# Altium schematic sheet Revisions.SchDoc
size A4; SheetNumber: 2; SheetTotal: 5
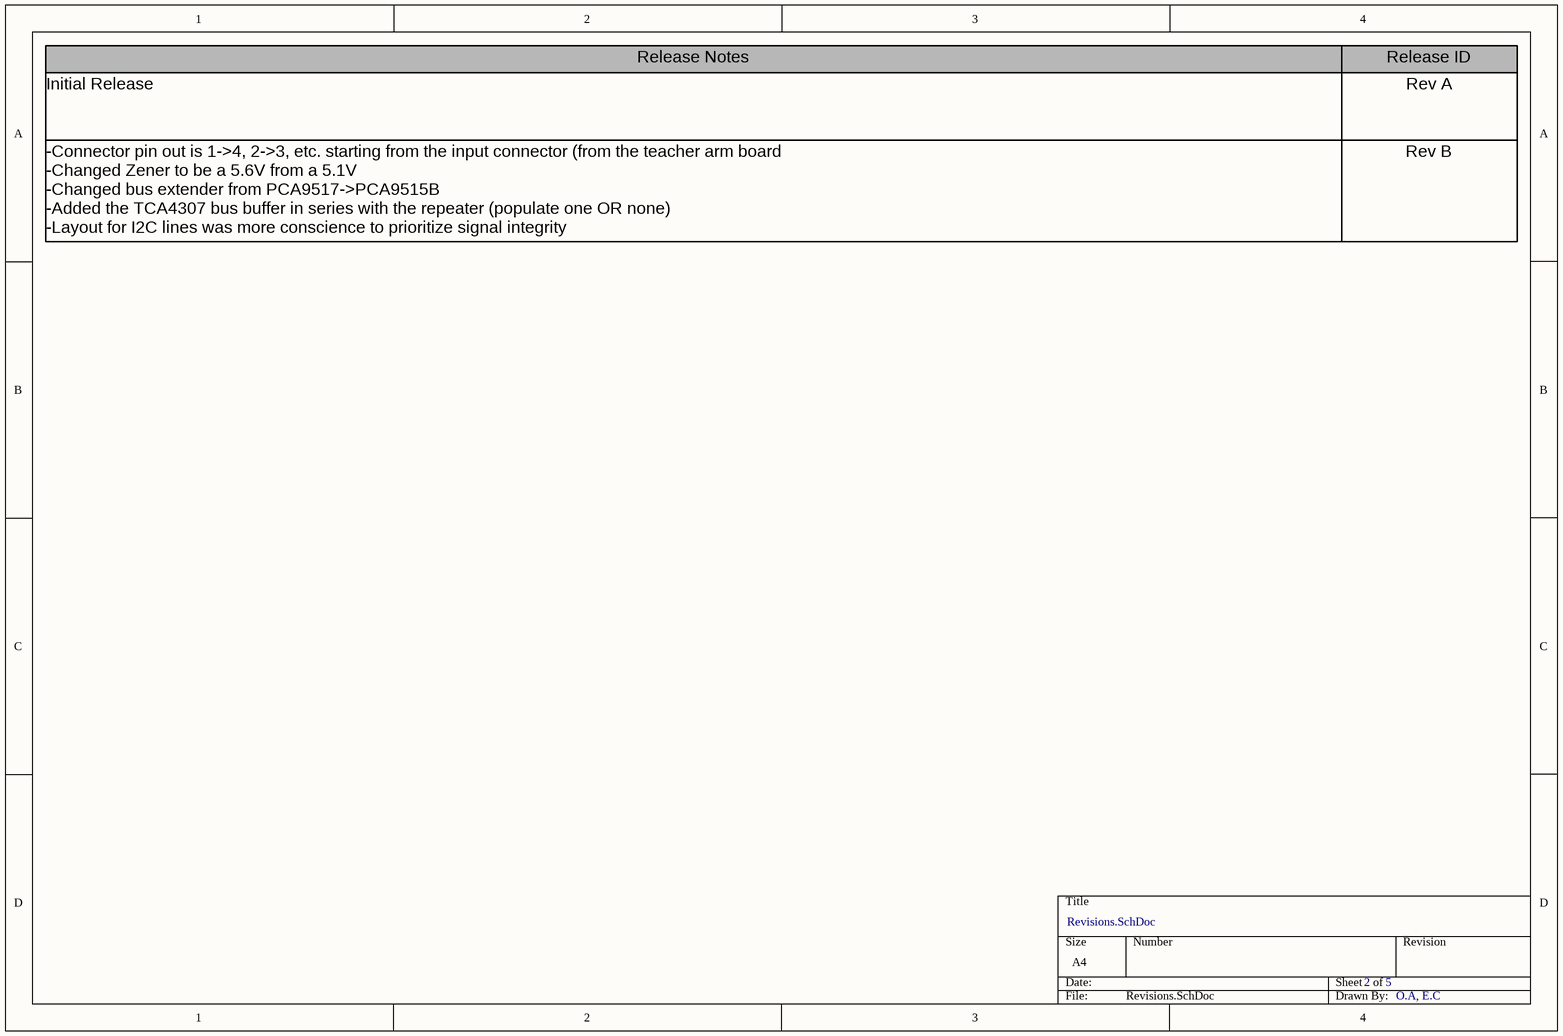
[diagram p0: Revisions.SchDoc]

## Notes on the sheet
- Release Notes
- Release ID
- Initial Release
- Rev A
- -Connector pin out is 1->4, 2->3, etc. starting from the input connector (from the teacher arm board
  -Changed Zener to be a 5.6V from a 5.1V
  -Changed bus extender from PCA9517->PCA9515B
  -Added the TCA4307 bus buffer in series with the repeater (populate one OR none)
  -Layout for I2C lines was more conscience to prioritize signal integrity
- Rev B
- O.A, E.C